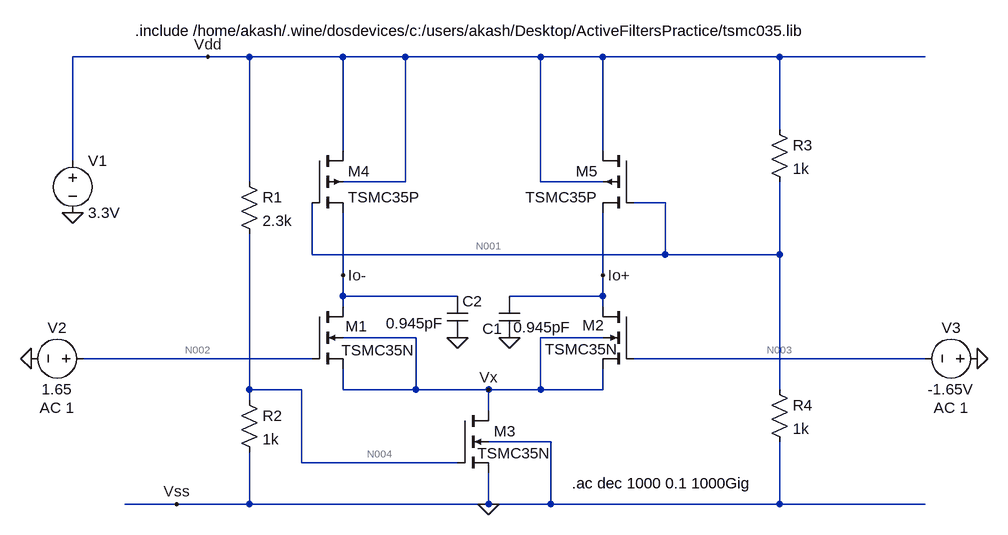
[diagram p0: schematic Final_Transconductor.asc]
Final_Transconductor.asc, the LTspice schematic file:
Version 4
SHEET 1 1012 876
WIRE -192 32 -400 32
WIRE -128 32 -192 32
WIRE 16 32 -128 32
WIRE 112 32 16 32
WIRE 320 32 112 32
WIRE 416 32 320 32
WIRE 688 32 416 32
WIRE 912 32 688 32
WIRE 688 144 688 32
WIRE 16 176 16 32
WIRE 416 176 416 32
WIRE -400 192 -400 32
WIRE -128 224 -128 32
WIRE 112 224 112 32
WIRE 112 224 16 224
WIRE 320 224 320 32
WIRE 416 224 320 224
WIRE 512 256 464 256
WIRE -32 336 -32 256
WIRE 512 336 512 256
WIRE 512 336 -32 336
WIRE 688 336 688 224
WIRE 688 336 512 336
WIRE 16 368 16 272
WIRE 416 368 416 272
WIRE 16 400 16 368
WIRE 192 400 16 400
WIRE 416 400 416 368
WIRE 416 400 272 400
WIRE 16 416 16 400
WIRE 416 416 416 400
WIRE 128 464 16 464
WIRE 416 464 320 464
WIRE -32 496 -384 496
WIRE 912 496 464 496
WIRE -128 544 -128 304
WIRE -48 544 -128 544
WIRE 16 544 16 512
WIRE 128 544 128 464
WIRE 128 544 16 544
WIRE 240 544 128 544
WIRE 320 544 320 464
WIRE 320 544 240 544
WIRE 416 544 416 512
WIRE 416 544 320 544
WIRE 688 544 688 336
WIRE -128 560 -128 544
WIRE 240 576 240 544
WIRE 336 624 240 624
WIRE -48 656 -48 544
WIRE 192 656 -48 656
WIRE -240 720 -320 720
WIRE -128 720 -128 640
WIRE -128 720 -240 720
WIRE 240 720 240 672
WIRE 240 720 -128 720
WIRE 336 720 336 624
WIRE 336 720 240 720
WIRE 688 720 688 624
WIRE 688 720 336 720
WIRE 912 720 688 720
FLAG -400 272 0
FLAG 240 720 0
FLAG -464 496 0
FLAG 992 496 0
FLAG 240 544 Vx
FLAG 416 368 Io+
FLAG 16 368 Io-
FLAG -192 32 Vdd
FLAG -240 720 Vss
FLAG 192 464 0
FLAG 272 464 0
SYMBOL voltage -400 176 R0
SYMATTR InstName V1
SYMATTR Value 3.3V
SYMBOL nmos4 -32 416 R0
WINDOW 3 46 67 Left 2
WINDOW 0 52 30 Left 2
SYMATTR Value TSMC35N
SYMATTR InstName M1
SYMATTR Value2 l=0.5u w=55u m=2
SYMBOL nmos4 464 416 M0
WINDOW 3 25 66 Left 2
WINDOW 0 46 29 Left 2
SYMATTR Value TSMC35N
SYMATTR InstName M2
SYMATTR Value2 l=0.5u w=55u m=2
SYMBOL nmos4 192 576 R0
WINDOW 3 31 66 Left 2
SYMATTR Value TSMC35N
SYMATTR InstName M3
SYMATTR Value2 l=0.5u w=12.2093u m=2
SYMBOL pmos4 -32 176 R0
SYMATTR InstName M4
SYMATTR Value TSMC35P
SYMATTR Value2 l=0.5u w=2u m=2
SYMBOL pmos4 464 176 M0
SYMATTR InstName M5
SYMATTR Value TSMC35P
SYMATTR Value2 l=0.5u w=2u m=2
SYMBOL voltage -368 496 R90
WINDOW 0 -32 56 VBottom 2
WINDOW 3 32 56 VTop 2
WINDOW 123 60 56 VTop 2
WINDOW 39 0 0 Left 0
SYMATTR InstName V2
SYMATTR Value 1.65
SYMATTR Value2 AC 1
SYMBOL voltage 1008 496 R90
WINDOW 0 -32 56 VBottom 2
WINDOW 3 32 56 VTop 2
WINDOW 123 60 56 VTop 2
WINDOW 39 0 0 Left 0
SYMATTR InstName V3
SYMATTR Value -1.65V
SYMATTR Value2 AC 1
SYMBOL res -144 208 R0
SYMATTR InstName R1
SYMATTR Value 2.3k
SYMBOL res -144 544 R0
SYMATTR InstName R2
SYMATTR Value 1k
SYMBOL res 672 128 R0
SYMATTR InstName R3
SYMATTR Value 1k
SYMBOL res 672 528 R0
SYMATTR InstName R4
SYMATTR Value 1k
SYMBOL cap 256 400 R0
WINDOW 0 -25 50 Left 2
WINDOW 3 22 48 Left 2
SYMATTR InstName C1
SYMATTR Value 0.945pF
SYMBOL cap 176 400 R0
WINDOW 3 -94 42 Left 2
SYMATTR Value 0.945pF
SYMATTR InstName C2
TEXT -304 -8 Left 2 !.include /home/akash/.wine/dosdevices/c:/users/akash/Desktop/ActiveFiltersPractice/tsmc035.lib
TEXT 368 688 Left 2 !.ac dec 1000 0.1 1000Gig

The netlist it stands for:
* Final_Transconductor.asc
V1 Vdd 0 3.3V
M1 Io- N002 Vx Vx TSMC35N l=0.5u w=55u m=2
M2 Io+ N003 Vx Vx TSMC35N l=0.5u w=55u m=2
M3 Vx N004 0 0 TSMC35N l=0.5u w=12.2093u m=2
M4 Vdd N001 Io- Vdd TSMC35P l=0.5u w=2u m=2
M5 Vdd N001 Io+ Vdd TSMC35P l=0.5u w=2u m=2
V2 N002 0 1.65 AC 1
V3 0 N003 -1.65V AC 1
R1 Vdd N004 2.3k
R2 N004 0 1k
R3 Vdd N001 1k
R4 N001 0 1k
C1 Io+ 0 0.945pF
C2 Io- 0 0.945pF
.model NMOS NMOS
.model PMOS PMOS
.lib standard.mos
.include /home/akash/.wine/dosdevices/c:/users/akash/Desktop/ActiveFiltersPractice/tsmc035.lib
.ac dec 1000 0.1 1000Gig
.backanno
.end

* Results of the author's LTspice run, read from the files saved beside the schematic
* Operating Point, zero values left out:
*   V(vdd) = 3.3 V
*   V(io-) = 1.65 V
*   V(n002) = 1.65 V
*   V(vx) = 828.6 mV
*   V(io+) = 1.65 V
*   V(n003) = 1.65 V
*   V(n004) = 1 V
*   V(n001) = 1.65 V
*   Id(M5) = 104.1 µA
*   Ib(M5) = 3.32 pA
*   Is(M5) = -104.1 µA
*   Id(M4) = 104.1 µA
*   Ib(M4) = 3.32 pA
*   Is(M4) = -104.1 µA
*   Id(M3) = 208.2 µA
*   Ib(M3) = -1.677 pA
*   Is(M3) = -208.2 µA
*   Id(M2) = 104.1 µA
*   Ib(M2) = -1.663 pA
*   Is(M2) = -104.1 µA
*   Id(M1) = 104.1 µA
*   Ib(M1) = -1.663 pA
*   Is(M1) = -104.1 µA
*   I(R4) = 1.65 mA
*   I(R3) = 1.65 mA
*   I(R2) = 1 mA
*   I(R1) = 1 mA
*   I(V1) = -2.858 mA